# Altium schematic sheet mil_battery_current_sensor.SchDoc
size B
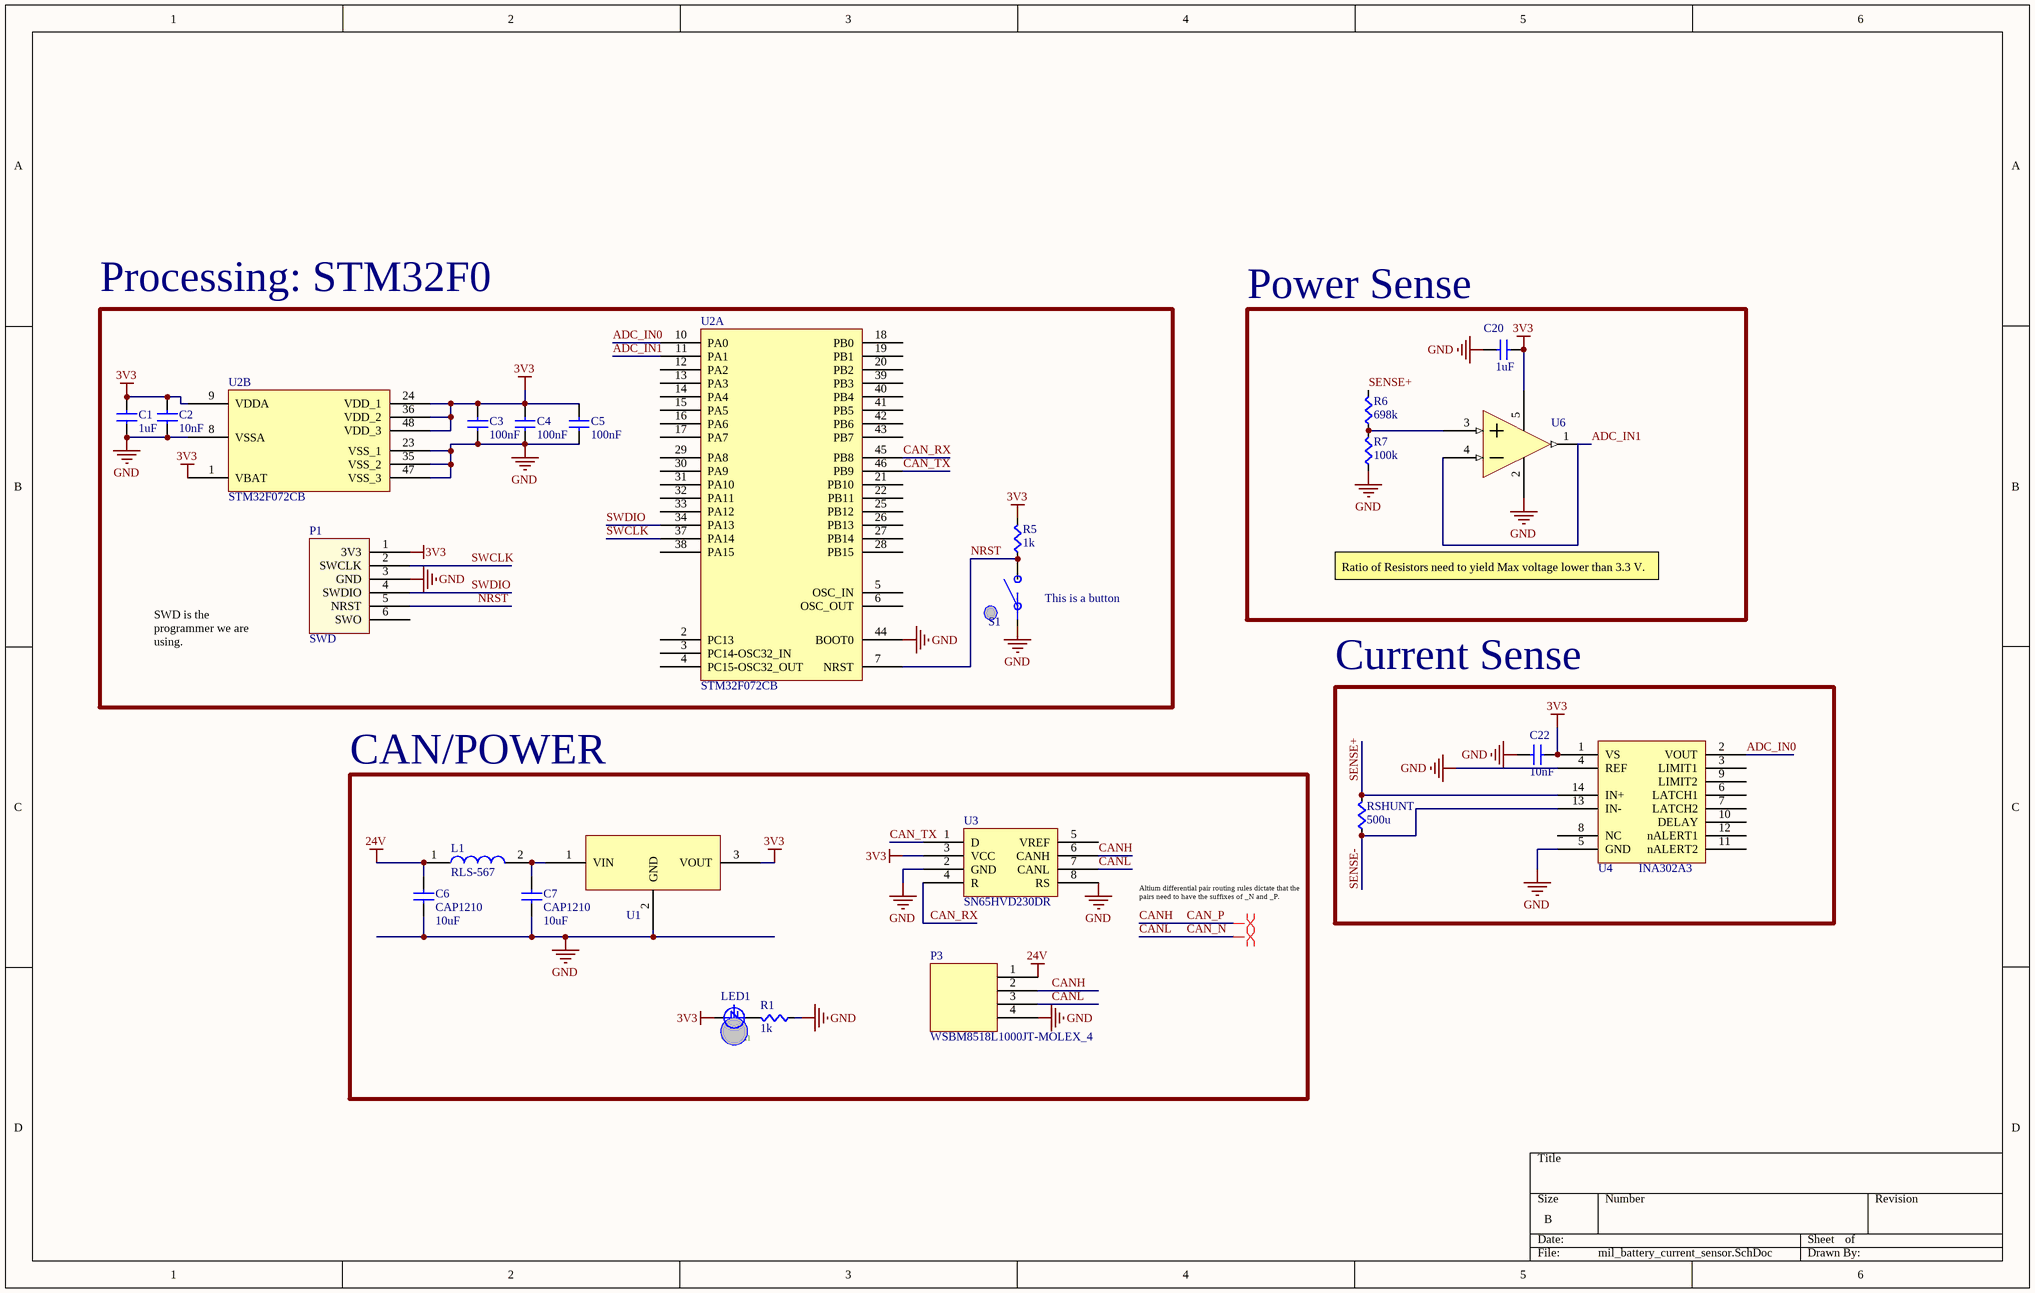
[diagram p0: mil_battery_current_sensor.SchDoc]

## Parts
C1  value 1uF  [CAPC0603]  (hidden comment: Cap)
C2  value 10nF  [CAPC0603]  (hidden comment: Cap)
C3  value 100nF  [CAPC0603]  (hidden comment: Cap)
C4  value 100nF  [CAPC0603]  (hidden comment: Cap)
C5  value 100nF  [CAPC0603]  (hidden comment: Cap)
C6  CAP1210  value 10uF  [CAP1210]
C7  CAP1210  value 10uF  [CAP1210]
C20  value 1uF  [CAPC0603]  (hidden comment: Cap)
C22  value 10nF  [CAPC0603]  (hidden comment: Cap)
L1  RLS-567  [RLS567]
LED1  Color: Green  [LED0603]  (hidden comment: LED)
P1  SWD  [SWD_STM32]
P3  WSBM8518L1000JT-MOLEX_4  [WSBM8518L1000JT-MOLEX_4]
R1  value 1k  [RES0603]  (hidden comment: Res)
R5  value 1k  [RES0603]  (hidden comment: Res)
R6  value 698k  [RES0603]  (hidden comment: Res)
R7  value 100k  [RES0603]  (hidden comment: Res)
RSHUNT  value 500u  [WSBM8518L5000JK]  (hidden comment: Res)
S1  Button  [PTS645xxxxSMTR92]  (value not drawn)
U1  R-78C3.3-1.0  [R-78C3.3-1.0]  (value not drawn)
U2  STM32F072CB  [STM32F072CB]  (parts A,B of 2)
U3  SN65HVD230DR  [SOIC-8pin]
U4  INA302A3  [INA302A2IPW]
U6  MCP6L01  [MCP6L01R]  (value not drawn)

## Blocks framed on the sheet
Processing: STM32F0: C1-C5 P1 R5 S1 U2
Power Sense: C20 R6 R7 U6
Current Sense: C22 RSHUNT U4
CAN/POWER: C6 C7 L1 LED1 P3 R1 U1 U3

## Nets
3V3: C1.1(A) C2.1(A) C3.1(A) C4.1(A) C5.1(A) C20.2(B) C22.2(B) LED1.A P1.1(3V3) R5.1(A) U1.3(VOUT) U2.1(VBAT) U2.9(VDDA) U2.24(VDD_1) U2.36(VDD_2) U2.48(VDD_3) U3.3(VCC) U4.1(VS) U6.5(VDD)
24V: C6.1(A) L1.1 P3.1
GND: C1.2(B) C2.2(B) C3.2(B) C4.2(B) C5.2(B) C6.2(B) C7.2(B) C20.1(A) C22.1(A) P1.3(GND) P3.4 R1.2(B) R7.2(B) S1.A U1.2(GND) U2.8(VSSA) U2.23(VSS_1) U2.35(VSS_2) U2.44(BOOT0) U2.47(VSS_3) U3.2(GND) U3.8(RS) U4.4(REF) U4.5(GND) U6.2(VSS)
ADC_IN0: U2.10(PA0) U4.2(VOUT)
ADC_IN1: U2.11(PA1) U6.1(VOUT) U6.4(VIN-)
CAN_N: P3.3 U3.7(CANL)  [also labelled CANL]
CAN_P: P3.2 U3.6(CANH)  [also labelled CANH]
CAN_RX: U2.45(PB8) U3.4(R)
CAN_TX: U2.46(PB9) U3.1(D)
NRST: P1.5(NRST) R5.2(B) S1.B U2.7(NRST)
SENSE+: R6.1(A) RSHUNT.1(A) U4.14(IN+)
SENSE-: RSHUNT.2(B) U4.13(IN-)
SWCLK: P1.2(SWCLK) U2.37(PA14)
SWDIO: P1.4(SWDIO) U2.34(PA13)
NetC7_1: C7.1(A) L1.2 U1.1(VIN)
NetLED1_C: LED1.C R1.1(A)
NetR6_2: R6.2(B) R7.1(A) U6.3(VIN+)

Not connected (* = marked no-connect by the designer): P1 6(SWO); U2 2(PC13) 3(PC14-OSC32_IN) 4(PC15-OSC32_OUT) 5(OSC_IN) 6(OSC_OUT) 12(PA2) 13(PA3) 14(PA4) 15(PA5) 16(PA6) 17(PA7) 18(PB0) 19(PB1) 20(PB2) 21(PB10) 22(PB11) 25(PB12) 26(PB13) 27(PB14) 28(PB15) 29(PA8) 30(PA9) 31(PA10) 32(PA11) 33(PA12) 38(PA15) 39(PB3) 40(PB4) 41(PB5) 42(PB6) 43(PB7); U3 5(VREF); U4 3(LIMIT1) 6(LATCH1) 7(LATCH2) 8(NC) 9(LIMIT2) 10(DELAY) 11(nALERT2) 12(nALERT1)

## Layout directives
differential pair: CAN_N, CAN_P

## Notes on the sheet
- (near S1) This is a button
- Ratio of Resistors need to yield Max voltage lower than 3.3 V.
- SWD is the programmer we are using.
- Altium differential pair routing rules dictate that the pairs need to have the suffixes of _N and _P.

## Library data of the parts
C1 C20 = Cap: Manufacturer Part Number: C0603C105K8PACTU; Supplier 1: Digi-Key; Supplier Part Number 1: 399-3118-2-ND
C6 C7 = CAP1210: CAP CER 10UF 50V 20% X5R 1210; Supplier 1: Digi-Key; Supplier Part Number 1: CGA6P1X7R1N106K250AC
L1 = RLS-567: Inductor; Manufacturer_Name: RECOM Power; Datasheet Link: https://componentsearchengine.com/Datasheets/1/RLS-567.pdf; Height: 3.1mm; Mouser Part Number: 919-RLS-567; Mouser Price/Stock: https://www.mouser.com/Search/Refine.aspx?Keyword=919-RLS-567; Manufacturer_Part_Number: RLS-567
P1 = SWD_STM32: SWD connector matching the pinout on STM Discovery Boards
P3 = WSBM8518L1000JT-MOLEX_4: 4 pins of molex type MX150 male to female connector; Mating Connector Part Number 1: WM15276-ND; Manufacturer 1: Vishay-Dale; Manufacturer Part Number 1: WSBM8518L1000JK; Supplier Number 1: Digi-Key; Supplier Part Number 1: 541-1906-ND
S1 = Button: SPST Button; Supplier 1: Digi-Key; Supplier Part Number 1: CKN9087CT-ND
U1 = R-78C3.3-1.0: CONV DC/DC 1A 3.3V OUT SIP VERT; Supplier 1: Digi-Key; Supplier Part Number 1: 945-1394-5-ND
U2 = STM32F072CB: MCU 32BIT 128KB FLASH 48LQFP; Supplier 1: Digi-Key; Supplier Part Number 1: 497-14645-ND
U3 = SN65HVD230DR: IC TXRX CAN 1MBPS 3.3V 8SOIC; Supplier 1: Digi-Key; Supplier Part Numbe 1: 296-11654-1-ND
U4 = INA302A2IPW: IC CURRENT SENSING AMP 14TSSOP; Manufacturer 1: Texas Instruments; Manufacturer Part Number 1: INA302A3IPW; Supplier 1: Digi-Key; Supplier Part Number 1: INA302A3QPWRQ1
U6 = MCP6L01: Op Amp Rail-to-Rail 1Mhz; Supplier 1: Digi-Key; Supplier Part Number 1: MCP6L01T-E/OTCT-ND
C2-C5 C22 = Cap: Supplier 1: Digi-Key
  C2 C22: Supplier Part Number 1: 490-1313-2-ND
  C3-C5: Supplier Part Number 1: 399-7374-2-ND
LED1 = LED: Supplier 1: Digi-Key; Supplier Part Number 1: 754-1122-1-ND
R1 R5-R7 RSHUNT = Res: Supplier 1: Digi-Key
  R1 R5: Supplier Part Number 1: RNF14FTD1K00TR-ND
  R6: Supplier Part Number 1: 634KXCT-ND
  R7: Supplier Part Number 1: 100KXTR-ND
  RSHUNT: Supplier Part Number 1: RMCF0603JT10K0CT-ND